# Altium schematic sheet Relay.SchDoc
size A; SheetNumber: 2; SheetTotal: 2
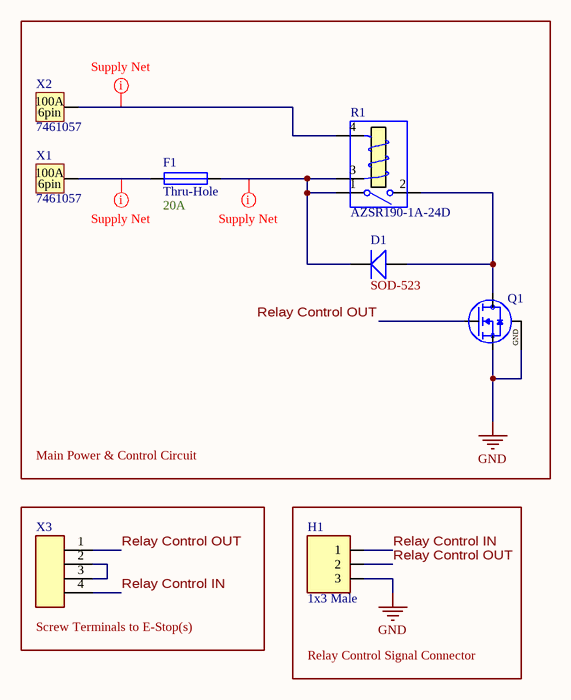
[diagram p0: Relay.SchDoc]

## Parts
D1  Size Package: SOD-523  [[Diode] SMD SOD-523]  (hidden comment: Rectifier)
F1  Thru-Hole  Capacity: 20A  [[Fuse] Thru-Hole Blade]
H1  1x3 Male  [[Header] Shrouded 1x3 Male]
Q1  [FET] NMOS IRF610PBF  [[FET] NMOS IRF610PBF]  (value not drawn)
R1  AZSR190-1A-24D  [[Relay] AZSR190-1A-24D]
X1  7461057  [[Port] Shank Connector (100A)]
X2  7461057  [[Port] Shank Connector (100A)]
X3  4pin Screw Terminal  [[Screw Terminal] 4pin 5mm]  (value not drawn)

## Blocks framed on the sheet
Main Power & Control Circuit: D1 F1 Q1 R1 X1 X2
Screw Terminals to E-Stop(s): X3
Relay Control Signal Connector: H1

## Nets
GND: H1.3 Q1.S(Source) Q1.X(GND)
Relay Control IN: H1.1 X3.4
Relay Control OUT: H1.2 Q1.G(Gate) X3.1
NetD1_1: D1.1(Cathode) F1.2 R1.1 R1.3(T1)
NetD1_2: D1.2(Anode) Q1.D(Drain) R1.2
NetF1_1: F1.1 X1.1
NetR1_4: R1.4(T2) X2.1
NetX3_2: X3.2 X3.3

## Layout directives
net class Supply_Nets: NetD1_1, NetF1_1, NetR1_4

## Notes on the sheet
- (in symbol [Port] Shank Connector (100A)) 100A; 6pin

## Library data of the parts
D1 = [Diode] SMD Rectifier: Generic; Mouser Part #: *; Supplier 1: DigiKey; Supplier Part Number 1: 1514-CMOD2004TRPBFREECT-ND
F1 = [Fuse] Thru-Hole Blade: Mouser Part #: *; Supplier 1: DigiKey; Supplier Part Number 1: WK6265-ND
H1 = [Header] Shrouded 1x3 Male: 070543-0037 / Mates with 005057-9403; Supplier 1: DigiKey; Supplier 2: DigiKey; Supplier Part Number 1: WM4825-ND; Supplier Part Number 2: WM2901-ND
Q1 = [FET] NMOS IRF610PBF: N-Channel 200 V 3.3A (Tc) 36W (Tc) Through Hole TO-220AB; Supplier 1: DigiKey; Supplier Part Number 1: IRF610PBF-ND
R1 = [Relay] AZSR190-1A-24D: Supplier 1: DigiKey; Supplier Part Number 1: 3385-AZSR190-1A-24D-ND
X1 X2 = [Port] Shank Connector (100A): 7461057, internal thread; Supplier 1: DigiKey; Supplier Part Number 1: 732-7461057-ND
X3 = [Screw Terminal] 4pin: Supplier 1: DigiKey; Supplier Part Number 1: 102-6147-ND